# EAGLE board Lichtsteuerung (EAGLE 6.6.0), part 1 of 2
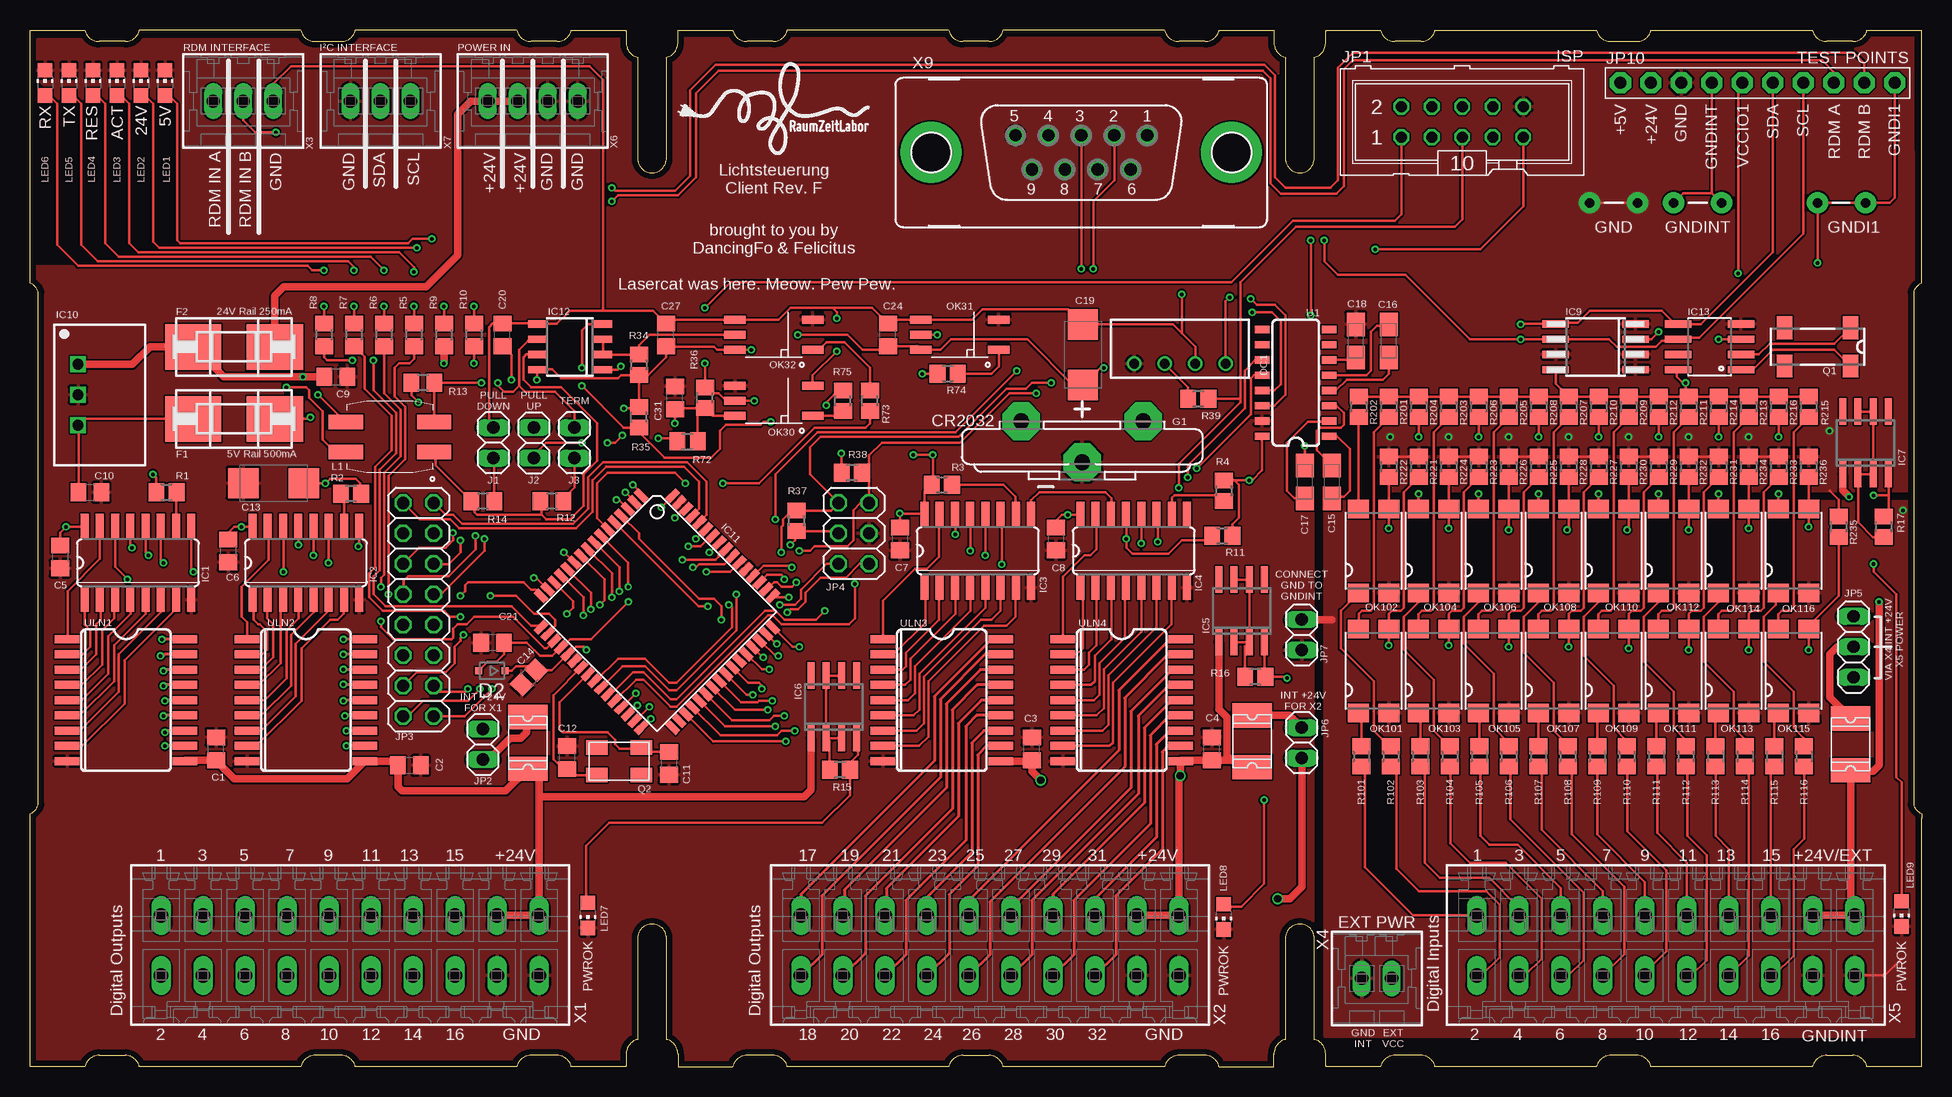
[diagram p2: board, top side]
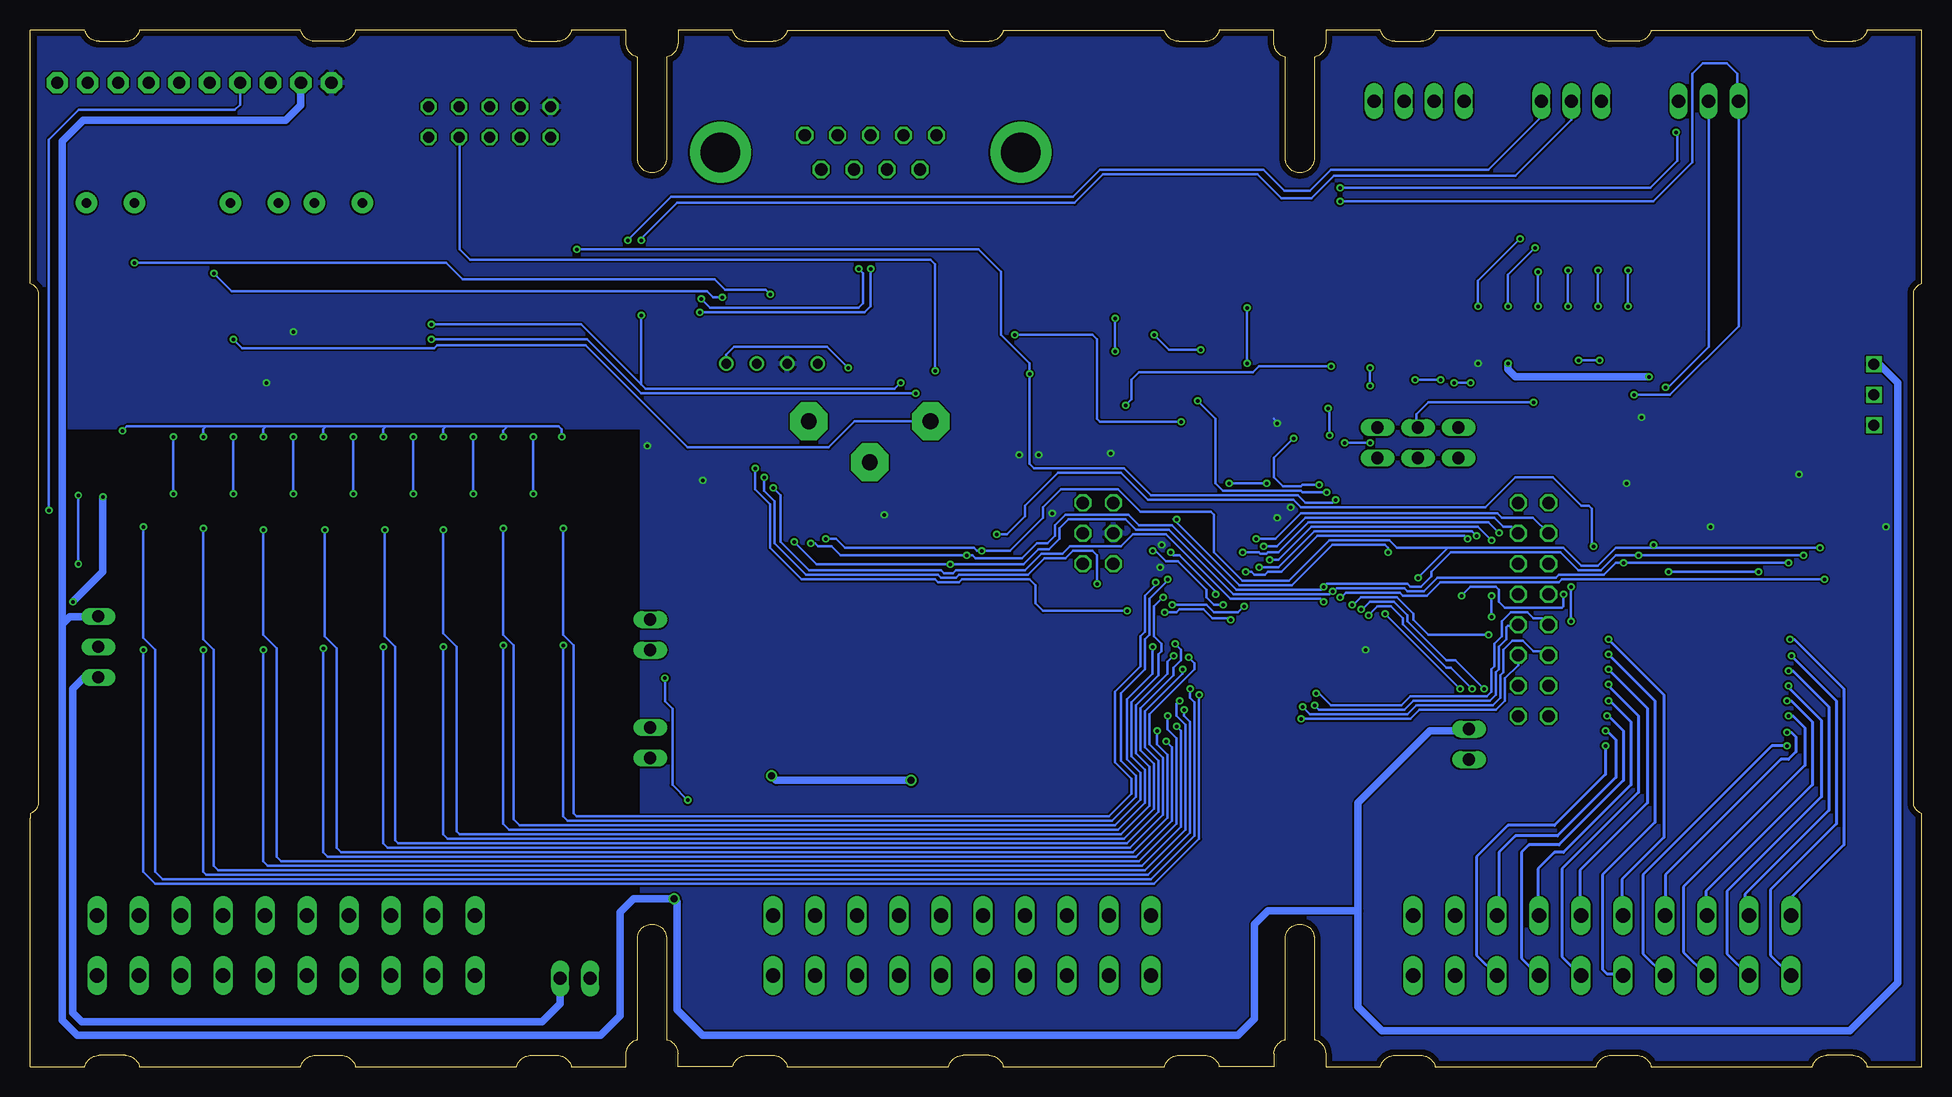
[diagram p3: board, bottom side, seen from below]

Size 157.7 x 86.4 mm. Coordinates in mm from the lower left corner, seen from the top.
Outline: 99.08,0.14 99.09,0.14
Outline: 45.08,0.14 45.09,0.14
Outline: 27.1,0.04 27.11,0.04
Outline: 9.08,0.14 9.09,0.14
Outline: 9.09,86.26 9.08,86.26
Outline: 45.09,86.26 45.08,86.26
Outline: 153.08,86.26 153.09,86.26
Outline: 157.7,0 153.12,0 arc78 151.95,0.95 149.75,0.95 arc78 148.58,0 135.12,0 arc78 133.95,0.95 131.75,0.95 arc78 130.58,0 117.12,0 arc78 115.95,0.95 113.75,0.95 arc78 112.58,0 108,0 108,1.1 arc78 107.05,2.27 107.05,10.7 arc12 107.02,10.95 arc29 106.75,11.49 arc97 104.95,11.49 arc29 104.68,10.95 arc12 104.65,10.7 104.65,2.27 arc78 103.7,1.1 103.7,0 99.12,0 arc78 97.95,0.95 95.75,0.95 arc78 94.58,0 81.12,0 arc78 79.95,0.95 77.75,0.95 arc78 76.58,0 63.12,0 arc78 61.95,0.95 59.75,0.95 arc78 58.58,0 54,0 54,1.1 arc78 53.05,2.27 53.05,10.7 arc12 53.02,10.95 arc29 52.75,11.49 arc97 50.95,11.49 arc29 50.68,10.95 arc12 50.65,10.7 50.65,2.27 arc78 49.7,1.1 49.7,0 45.12,0 arc78 43.95,0.95 41.75,0.95 arc78 40.58,0 27.12,0 arc78 25.95,0.95 23.75,0.95 arc78 22.58,0 9.12,0 arc78 7.95,0.95 5.75,0.95 arc78 4.58,0 0,0 0,20.7 0,21.09 arc51 0.7,21.85 0.7,64.55 arc51 0,65.31 0,86.4 4.58,86.4 arc78 5.75,85.45 7.95,85.45 arc78 9.12,86.4 22.58,86.4 arc78 23.75,85.45 25.95,85.45 arc78 27.12,86.4 40.58,86.4 arc78 41.75,85.45 43.95,85.45 arc78 45.12,86.4 49.7,86.4 49.7,85.3 arc78 50.65,84.13 50.65,75.7 arc12 50.68,75.45 arc29 50.95,74.91 arc97 52.75,74.91 arc29 53.02,75.45 arc12 53.05,75.7 53.05,84.13 arc78 54,85.3 54,86.4 58.58,86.4 arc78 59.75,85.45 61.95,85.45 arc78 63.12,86.4 76.58,86.4 arc78 77.75,85.45 79.95,85.45 arc78 81.12,86.4 94.58,86.4 arc78 95.75,85.45 97.95,85.45 arc78 99.12,86.4 103.7,86.4 103.7,85.3 arc78 104.65,84.13 104.65,75.7 arc12 104.68,75.45 arc29 104.95,74.91 arc97 106.75,74.91 arc29 107.02,75.45 arc12 107.05,75.7 107.05,84.13 arc78 108,85.3 108,86.4 112.58,86.4 arc78 113.75,85.45 115.95,85.45 arc78 117.12,86.4 130.58,86.4 arc78 131.75,85.45 133.95,85.45 arc78 135.12,86.4 148.58,86.4 arc78 149.75,85.45 151.95,85.45 arc78 153.12,86.4 157.7,86.4 157.7,65.31 arc51 157,64.55 157,21.85 arc51 157.7,21.09 157.7,20.7 157.7,0
Copper layers (1*16): Top 0.035mm / dielectric 1.5mm / Bottom 0.035mm
Design rules "aetzwerk *": minimum track width 6mil, minimum drill 0.3mm, track to track 6mil, track to pad 6mil, pad to pad 6mil, via to via 6mil, smd to smd 6mil, copper to edge 20mil, drill to drill 8mil, minimum pad ring 8mil, minimum via ring 6mil, stop-mask expansion 3mil, vias tented up to drill 0mil, thermal gap 8mil
Net classes: 1 24v-2a: width 0.508 mm, clearance 0.102 mm; 2 24v-500ma: width 0.254 mm, clearance 0.102 mm
tKeepout: 152 lines

## Footprints (pad centres in the part's own frame; a part is rotated, then mirrored left to right if it is on the bottom)
C0805 = smd 1.3 x 1.5: 1 -0.95,0; 2 0.95,0
C/6032-28R = smd 2.55 x 2.5: + 2.525,0; - -2.525,0
C0805' = smd 1.3 x 1.5: 1 -0.85,0; 2 0.85,0
A/3216-18R = smd 1.95 x 1.5: + 1.375,0; - -1.375,0
SOD323-R = smd 0.6 x 0.6: A 1.1,0; C -1.1,0
4SIL = drill 0.8: 1 -3.81,0; 2 -1.27,0; 3 1.27,0; 4 3.81,0
OMNIBLOK = smd 4.7 x 3.8: P$1 -3.4,0; P$2 3.4,0
1812L = smd 2.03 x 3.3: P$1 -2.16,0; P$2 2.16,0
CR2032V2 = drill 1.321 pad 3.15 octagon: + -2.54,-5.08; +@1 -2.54,5.08; - 0.876,0
SO16 = smd 0.66 x 2.032: 1 -4.445,-3.073; 2 -3.175,-3.073; 3 -1.905,-3.073; 4 -0.635,-3.073; 5 0.635,-3.073; 6 1.905,-3.073; 7 3.175,-3.073; 8 4.445,-3.073; 9 4.445,3.073; 10 3.175,3.073; 11 1.905,3.073; 12 0.635,3.073; 13 -0.635,3.073; 14 -1.905,3.073; 15 -3.175,3.073; 16 -4.445,3.073
SO08 = smd 0.6 x 2.2: 1 -1.905,-2.6; 2 -0.635,-2.6; 3 0.635,-2.6; 4 1.905,-2.6; 5 1.905,2.6; 6 0.635,2.6; 7 -0.635,2.6; 8 -1.905,2.6
SO-08M = smd 0.6 x 2.2: 1 -1.905,-3.33; 2 -0.635,-3.33; 3 0.635,-3.33; 4 1.905,-3.33; 5 1.905,3.33; 6 0.635,3.33; 7 -0.635,3.33; 8 -1.905,3.33
TSR-1 = drill 0.9 square: 1 -2.54,0; 2 0,0; 3 2.54,0
TQFP64 = smd 1.194 x 0.559: 1 -7.76,5.905; 2 -7.76,5.118; 3 -7.76,4.331; 4 -7.76,3.543; 5 -7.76,2.756; 6 -7.76,1.968; 7 -7.76,1.181; 8 -7.76,0.394; 9 -7.76,-0.394; 10 -7.76,-1.181; 11 -7.76,-1.968; 12 -7.76,-2.756; 13 -7.76,-3.543; 14 -7.76,-4.331; 15 -7.76,-5.118; 16 -7.76,-5.905; 33 7.76,-5.905; 34 7.76,-5.118; 35 7.76,-4.331; 36 7.76,-3.543; 37 7.76,-2.756; 38 7.76,-1.968; 39 7.76,-1.181; 40 7.76,-0.394; 41 7.76,0.394; 42 7.76,1.181; 43 7.76,1.968; 44 7.76,2.756; 45 7.76,3.543; 46 7.76,4.331; 47 7.76,5.118; 48 7.76,5.905 | smd 0.559 x 1.194: 17 -5.905,-7.76; 18 -5.118,-7.76; 19 -4.331,-7.76; 20 -3.543,-7.76; 21 -2.756,-7.76; 22 -1.968,-7.76; 23 -1.181,-7.76; 24 -0.394,-7.76; 25 0.394,-7.76; 26 1.181,-7.76; 27 1.968,-7.76; 28 2.756,-7.76; 29 3.543,-7.76; 30 4.331,-7.76; 31 5.118,-7.76; 32 5.905,-7.76; 49 5.905,7.76; 50 5.118,7.76; 51 4.331,7.76; 52 3.543,7.76; 53 2.756,7.76; 54 1.968,7.76; 55 1.181,7.76; 56 0.394,7.76; 57 -0.394,7.76; 58 -1.181,7.76; 59 -1.968,7.76; 60 -2.756,7.76; 61 -3.543,7.76; 62 -4.331,7.76; 63 -5.118,7.76; 64 -5.905,7.76
D_R-PDSO-G8 = smd 0.6 x 1.5: 1 -1.905,-2.75; 2 -0.635,-2.75; 3 0.635,-2.75; 4 1.905,-2.75; 5 1.905,2.75; 6 0.635,2.75; 7 -0.635,2.75; 8 -1.905,2.75
SO08' = smd 0.61 x 2.21: 1 -1.905,-2.616; 2 -0.635,-2.616; 3 0.635,-2.616; 4 1.905,-2.616; 5 1.905,2.616; 6 0.635,2.616; 7 -0.635,2.616; 8 -1.905,2.616
1X02 = drill 1.016 long: 1 -1.27,0; 2 1.27,0
ML10 = drill 0.914 octagon: 1 -5.08,-1.27; 2 -5.08,1.27; 3 -2.54,-1.27; 4 -2.54,1.27; 5 0,-1.27; 6 0,1.27; 7 2.54,-1.27; 8 2.54,1.27; 9 5.08,-1.27; 10 5.08,1.27
2X08 = drill 1.016 octagon: 1 -8.89,-1.27; 2 -8.89,1.27; 3 -6.35,-1.27; 4 -6.35,1.27; 5 -3.81,-1.27; 6 -3.81,1.27; 7 -1.27,-1.27; 8 -1.27,1.27; 9 1.27,-1.27; 10 1.27,1.27; 11 3.81,-1.27; 12 3.81,1.27; 13 6.35,-1.27; 14 6.35,1.27; 15 8.89,-1.27; 16 8.89,1.27
2X03 = drill 1.016 octagon: 1 -2.54,-1.27; 2 -2.54,1.27; 3 0,-1.27; 4 0,1.27; 5 2.54,-1.27; 6 2.54,1.27
1X03 = drill 1.016 long: 1 -2.54,0; 2 0,0; 3 2.54,0
1X10-BIG = drill 1.016 pad 1.778 octagon: 1 -11.43,0; 2 -8.89,0; 3 -6.35,0; 4 -3.81,0; 5 -1.27,0; 6 1.27,0; 7 3.81,0; 8 6.35,0; 9 8.89,0; 10 11.43,0
EPCOS_B82790_SERIES = smd 2.85 x 1.2: 1 -3.675,-1.25; 2 3.675,-1.25; 3 -3.675,1.25; 4 3.675,1.25
CHIP-LED0805 = smd 1.2 x 1.2: A 0,-1.05; C 0,1.05
JEDEC_MS-012-AA_SOIC5 = smd 1.8 x 0.64: 1 -3.235,1.25; 3 -3.235,-1.25; 4 3.235,-1.25; 5 3.235,0; 6 3.235,1.25
SMD4 = smd 1.78 x 1.55: 1 -1.27,-3.5; 2 1.27,-3.5; 3 1.27,3.5; 4 -1.27,3.5
MC-306 = smd 1.3 x 1.9: 1 -2.75,-1.6; 2 2.75,-1.6; 3 2.75,1.6; 4 -2.75,1.6
MJ = smd 1.8 x 1.2: P1 -1.85,-1.15; P2 1.85,-1.15; P3 1.85,1.15; P4 -1.85,1.15
R0805 = smd 1.3 x 1.5: 1 -0.85,0; 2 0.85,0
R0805' = smd 1.3 x 1.5: 1 -0.95,0; 2 0.95,0
SO016 = smd 0.6 x 1.2: 1 -4.445,-2.8; 2 -3.175,-2.8; 3 -1.905,-2.8; 4 -0.635,-2.8; 5 0.635,-2.8; 6 1.905,-2.8; 7 3.175,-2.8; 8 4.445,-2.8; 9 4.445,2.8; 10 3.175,2.8; 11 1.905,2.8; 12 0.635,2.8; 13 -0.635,2.8; 14 -1.905,2.8; 15 -3.175,2.8; 16 -4.445,2.8
SO18L = smd 0.66 x 2.032: 1 -0.635,-4.902; 2 0.635,-4.902; 3 1.905,-4.902; 4 3.175,-4.902; 5 4.445,-4.902; 6 5.715,-4.902; 7 6.985,-4.902; 8 8.255,-4.902; 9 9.525,-4.902; 10 9.525,4.902; 11 8.255,4.902; 12 6.985,4.902; 13 5.715,4.902; 14 4.445,4.902; 15 3.175,4.902; 16 1.905,4.902; 17 0.635,4.902; 18 -0.635,4.902
P-713-1410 = drill 1.2 long: L1 -2.45,-15.75; L2 2.55,-15.75; L3 -2.45,-12.25; L4 2.55,-12.25; L5 -2.45,-8.75; L6 2.55,-8.75; L7 -2.45,-5.25; L8 2.55,-5.25; L9 -2.45,-1.75; L10 2.55,-1.75; L11 -2.45,1.75; L12 2.55,1.75; L13 -2.45,5.25; L14 2.55,5.25; L15 -2.45,8.75; L16 2.55,8.75; L17 -2.45,12.25; L18 2.55,12.25; L19 -2.45,15.75; L20 2.55,15.75
P-733-333 = drill 1.1 long: L1 0,-2.5; L2 0,0; L3 0,2.5
P-733-332 = drill 1.1 long: L1 0,-1.25; L2 0,1.25
P-733-334 = drill 1.1 long: L1 0,-3.75; L2 0,-1.25; L3 0,1.25; L4 0,3.75
F09VP = drill 1.016 octagon: 1 5.486,1.422; 2 2.743,1.422; 3 0,1.422; 4 -2.743,1.422; 5 -5.486,1.422; 6 4.115,-1.422; 7 1.372,-1.422; 8 -1.372,-1.422; 9 -4.115,-1.422 | drill 3.302 pad 5.08: G1 -12.522,0; G2 12.522,0

## Placement (x,y rotation side)
C1  100n  [C0805]  15.5,26.5 90 top
C2  100n  [C0805]  31.63,25.12 0 top
C3  100n  [C0805]  83.5,26.5 90 top
C4  100n  [C0805]  98.5,26.5 90 top
C5  100n  [C0805]  2.5,42.5 270 top
C6  100n  [C0805]  16.5,43 270 top
C7  100n  [C0805]  72.5,44 270 top
C8  100n  [C0805]  85.5,44 270 top
C9  1µ  [C0805]  25.5,57.5 0 top
C10  100n  [C0805]  5,47.88 0 top
C11  22p  [C0805]  53.25,25.29 270 top
C12  22p  [C0805]  44.79,25.77 90 top
C13  10µ  [C/6032-28R]  20.3,48.63 0 top
C14  100n  [C0805']  41.59,32.45 225 top
C15  1µ  [A/3216-18R]  108.5,48.75 270 top
C16  1µ  [A/3216-18R]  113.25,60.5 270 top
C17  1µ  [A/3216-18R]  106.25,48.75 270 top
C18  1µ  [A/3216-18R]  110.5,60.5 90 top
C19  10µ  [C/6032-28R]  87.78,59.34 270 top
C20  100n  [C0805]  39.38,61 90 top
C21  100n  [C0805]  38.56,35.35 180 top
C24  100n  [C0805]  71.5,61 90 top
C27  100n  [C0805]  53,61 90 top
C31  100n  [C0805]  53.75,55.75 90 top
D2  [SOD323-R]  38.5,33 180 top
DC1  VA-0505S  [4SIL]  95.85,58.59 0 top
F1  5V Rail 500mA  [OMNIBLOK]  17,54 0 top
F2  24V Rail 250mA  [OMNIBLOK]  17,60 0 top
F3  500mA  [1812L]  41.5,27 90 top
F4  500mA  [1812L]  101.88,27.12 270 top
F5  500mA  [1812L]  151.75,26.88 270 top
G1  CR2032V  [CR2032V2]  87.71,51.25 270 top
IC1  74HC595D  [SO16]  9,42 0 top
IC2  74HC595D  [SO16]  23,42 0 top
IC3  74HC595D  [SO16]  79,43 0 top
IC4  74HC595D  [SO16]  92,43 0 top
IC5  LM317LD  [SO08]  101,38 0 top
IC6  LM317LD  [SO08]  67,30 0 top
IC7  LM317LD  [SO08]  153,52 0 top
IC9  24FC128-I/SN  [SO-08M]  130.5,60 90 top
IC10  TSR_1-2450  [TSR-1]  4,56 270 top
IC11  MEGA64-A  [TQFP64]  52.26,37.93 315 top
IC12  75176AD  [D_R-PDSO-G8]  45,60 90 top
IC13  DS1307SO8  [SO08']  140,60 90 top
J1  [1X02]  38.63,52 270 top
J2  [1X02]  42,52 90 top
J3  [1X02]  45.38,52 270 top
JP1  [ML10]  119.38,78.74 0 top
JP2  [1X02]  37.75,26.88 90 top
JP3  [2X08]  32.39,38.1 270 top
JP4  [2X03]  68.68,44.45 270 top
JP5  [1X03]  152,35 90 top
JP6  [1X02]  106,27 270 top
JP7  [1X02]  106,36 90 top
JP10  PINHD-1X10  [1X10-BIG]  144,82 0 top
L1  2x51µH  [EPCOS_B82790_SERIES]  30,52.5 180 top
LED1  5V  [CHIP-LED0805]  11.25,82 0 top
LED2  24V  [CHIP-LED0805]  9.25,82 0 top
LED3  ACT  [CHIP-LED0805]  7.25,82 0 top
LED4  RES  [CHIP-LED0805]  5.25,82 0 top
LED5  TX  [CHIP-LED0805]  3.25,82 0 top
LED6  RX  [CHIP-LED0805]  1.25,82 0 top
LED7  PWROK  [CHIP-LED0805]  46.5,12.62 180 top
LED8  PWROK  [CHIP-LED0805]  99.5,12.5 180 top
LED9  PWROK  [CHIP-LED0805]  156,12.75 180 top
OK30  ACPL-M50L  [JEDEC_MS-012-AA_SOIC5]  62,55.5 180 top
OK31  ACPL-M50L  [JEDEC_MS-012-AA_SOIC5]  77.5,61 180 top
OK32  ACPL-M50L  [JEDEC_MS-012-AA_SOIC5]  62,61 180 top
OK101  LTV356T  [SMD4]  112,33 0 top
OK102  LTV356T  [SMD4]  112,43 0 top
OK103  LTV356T  [SMD4]  117,33 0 top
OK104  LTV356T  [SMD4]  117,43 0 top
OK105  LTV356T  [SMD4]  122,33 0 top
OK106  LTV356T  [SMD4]  122,43 0 top
OK107  LTV356T  [SMD4]  127,33 0 top
OK108  LTV356T  [SMD4]  127,43 0 top
OK109  LTV356T  [SMD4]  132,33 0 top
OK110  LTV356T  [SMD4]  132,43 0 top
OK111  LTV356T  [SMD4]  137,33 0 top
OK112  LTV356T  [SMD4]  137,43 0 top
OK113  LTV356T  [SMD4]  142,33 0 top
OK114  LTV356T  [SMD4]  142,43 0 top
OK115  LTV356T  [SMD4]  147,33 0 top
OK116  LTV356T  [SMD4]  147,43 0 top
Q1  32.768  [MC-306]  149,60 180 top
Q2  16MHz  [MJ]  49.11,25.46 0 top
R1  1k  [R0805]  11.38,47.88 0 top
R2  1k  [R0805]  26.75,47.75 180 top
R3  1k  [R0805]  76,48.5 0 top
R4  1k  [R0805]  99.5,48 270 top
R5  220  [R0805']  32,61 270 top
R6  220  [R0805']  29.5,61 270 top
R7  220  [R0805']  27,61 270 top
R8  220  [R0805']  24.5,61 270 top
R9  1,5k  [R0805']  34.5,61 270 top
R10  220  [R0805']  37,61 270 top
R11  10k  [R0805]  99.38,44.25 0 top
R12  120  [R0805']  43.5,47.12 180 top
R13  680  [R0805']  32.75,57 180 top
R14  680  [R0805']  37.75,47.12 180 top
R15  125  [R0805]  67.5,24.75 180 top
R16  125  [R0805]  102.13,32.5 180 top
R17  125  [R0805]  154.5,45 270 top
R34  1k  [R0805]  50.75,58.5 270 top
R35  1k  [R0805]  50.75,54.12 90 top
R36  1k  [R0805]  56.25,55.75 90 top
R37  10k  [R0805]  63.88,45.5 270 top
R38  10k  [R0805]  68.5,49.5 180 top
R39  10k  [R0805]  97.38,55.66 180 top
R72  10k  [R0805]  54.8,52.11 0 top
R73  220  [R0805]  70,55.5 90 top
R74  220  [R0805]  76.5,57.77 0 top
R75  220  [R0805]  67.75,55.5 90 top
R101  1.2k  [R0805]  110.97,25.86 270 top
R102  1.2k  [R0805]  113.43,25.86 270 top
R103  1.2k  [R0805]  115.89,25.86 270 top
R104  1.2k  [R0805]  118.35,25.86 270 top
R105  1.2k  [R0805]  120.81,25.86 270 top
R106  1.2k  [R0805]  123.27,25.86 270 top
R107  1.2k  [R0805]  125.73,25.86 270 top
R108  1.2k  [R0805]  128.19,25.86 270 top
R109  1.2k  [R0805]  130.65,25.86 270 top
R110  1.2k  [R0805]  133.11,25.86 270 top
R111  1.2k  [R0805]  135.57,25.86 270 top
R112  1.2k  [R0805]  138.03,25.86 270 top
R113  1.2k  [R0805]  140.49,25.86 270 top
R114  1.2k  [R0805]  142.95,25.86 270 top
R115  1.2k  [R0805]  145.41,25.86 270 top
R116  1.2k  [R0805]  147.87,25.86 270 top
R201  10k  [R0805]  113.25,55 270 top
R202  10k  [R0805]  110.75,55 270 top
R203  10k  [R0805]  118.25,55 270 top
R204  10k  [R0805]  115.75,55 270 top
R205  10k  [R0805]  123.25,55 270 top
R206  10k  [R0805]  120.75,55 270 top
R207  10k  [R0805]  128.25,55 270 top
R208  10k  [R0805]  125.75,55 270 top
R209  10k  [R0805]  133.25,55 270 top
R210  10k  [R0805]  130.75,55 270 top
R211  10k  [R0805]  138.25,55 270 top
R212  10k  [R0805]  135.75,55 270 top
R213  10k  [R0805]  143.25,55 270 top
R214  10k  [R0805]  140.75,55 270 top
R215  10k  [R0805]  148.25,55 270 top
R216  10k  [R0805]  145.75,55 270 top
R221  47k  [R0805]  115.75,50 270 top
R222  47k  [R0805]  113.25,50 270 top
R223  47k  [R0805]  120.75,50 270 top
R224  47k  [R0805]  118.25,50 270 top
R225  47k  [R0805]  125.75,50 270 top
R226  47k  [R0805]  123.25,50 270 top
R227  47k  [R0805]  130.75,50 270 top
R228  47k  [R0805]  128.25,50 270 top
R229  47k  [R0805]  135.75,50 270 top
R230  47k  [R0805]  133.25,50 270 top
R231  47k  [R0805]  140.75,50 270 top
R232  47k  [R0805]  138.25,50 270 top
R233  47k  [R0805]  145.75,50 270 top
R234  47k  [R0805]  143.25,50 270 top
R235  47k  [R0805]  150.75,45 270 top
R236  47k  [R0805]  148.25,50 270 top
U1  MAX232SOIC16  [SO016]  105.5,57 90 top
U$1  [RAUMZEITLABOR_FILLED_16MM]  62,80 0 top
ULN1  [SO18L]  8,35 270 top
ULN2  [SO18L]  23,35 270 top
ULN3  [SO18L]  76,35 270 top
ULN4  [SO18L]  91,35 270 top
X1  713-1410  [P-713-1410]  26.67,10.16 270 top
X2  713-1410  [P-713-1410]  80.01,10.16 270 top
X3  733-333  [P-733-333]  17.78,80.47 90 top
X4  733-332  [P-733-332]  112.25,7.38 90 top
X5  713-1410  [P-713-1410]  136.35,10.16 270 top
X6  733-334  [P-733-334]  41.91,80.47 90 top
X7  733-333  [P-733-333]  29.21,80.47 90 top
X9  [F09VP]  87.63,76.2 0 top